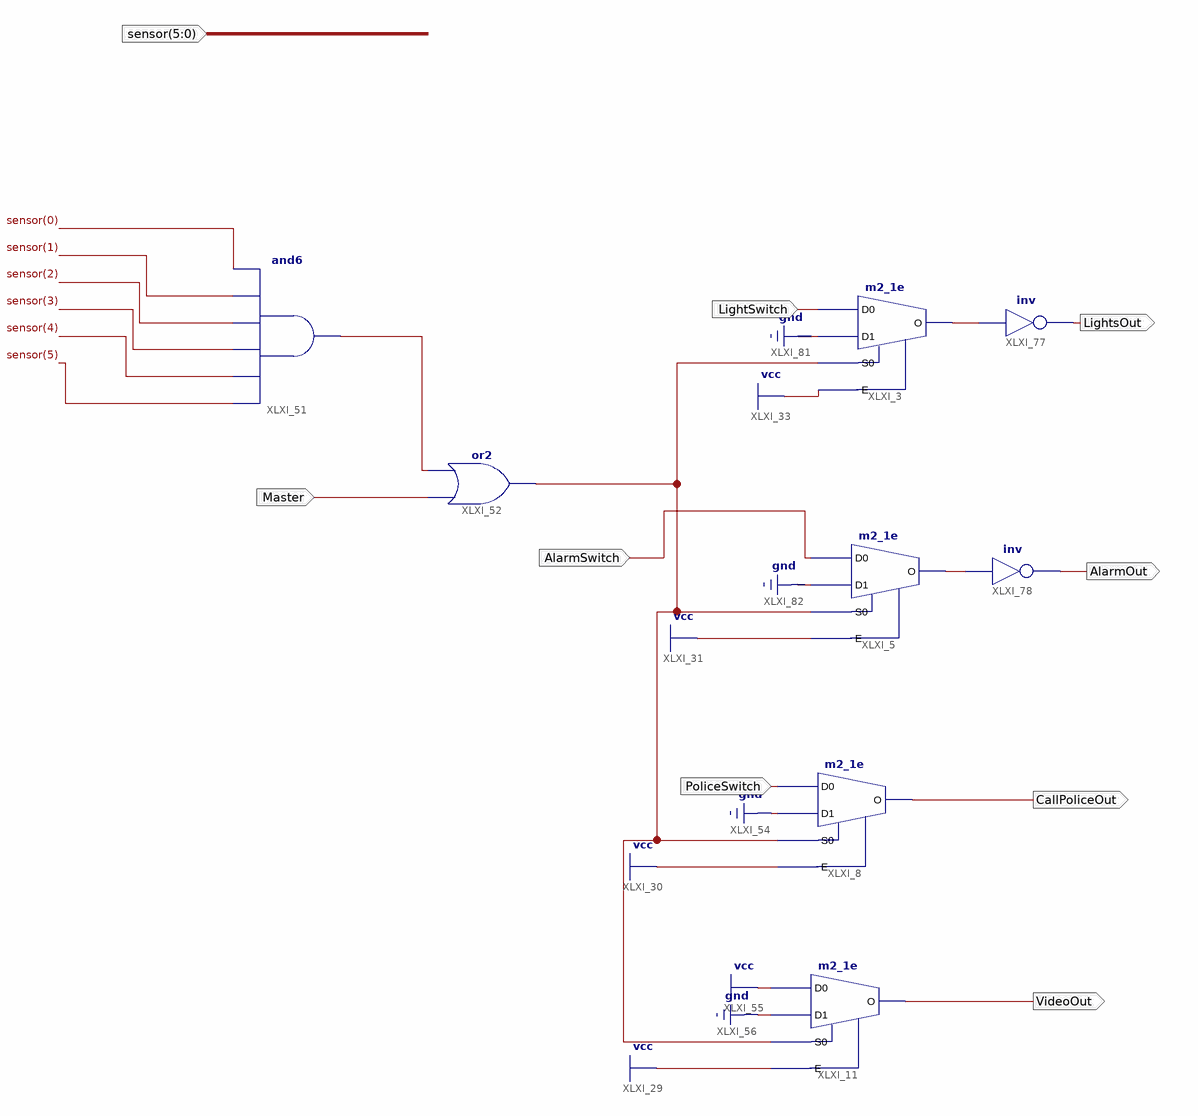
[diagram p0: schematic sheet 1]
// Xilinx ISE schematic alarmcontroller.sch (spartan3) as structural Verilog: 8 symbols, 9 ports
module alarmcontroller (
  input  [5:0] sensor,
  input  Master,
  input  PoliceSwitch,
  input  LightSwitch,
  input  AlarmSwitch,
  output VideoOut,
  output CallPoliceOut,
  output LightsOut,
  output AlarmOut
);

  wire XLXN_111, XLXN_119, XLXN_161, XLXN_164;

  m2_1e XLXI_3 (.D0(LightSwitch), .D1(1'b0), .E(1'b1), .S0(XLXN_111), .O(XLXN_161));
  m2_1e XLXI_5 (.D0(AlarmSwitch), .D1(1'b0), .E(1'b1), .S0(XLXN_111), .O(XLXN_164));
  m2_1e XLXI_11 (.D0(1'b1), .D1(1'b0), .E(1'b1), .S0(XLXN_111), .O(VideoOut));
  and XLXI_51 (XLXN_119, sensor[5], sensor[4], sensor[3], sensor[2], sensor[1], sensor[0]);
  or XLXI_52 (XLXN_111, Master, XLXN_119);
  m2_1e XLXI_8 (.D0(PoliceSwitch), .D1(1'b0), .E(1'b1), .S0(XLXN_111), .O(CallPoliceOut));
  not XLXI_77 (LightsOut, XLXN_161);
  not XLXI_78 (AlarmOut, XLXN_164);
endmodule
